# Altium schematic sheet betterfc_v0.2.SchDoc: BetterFC
size A3; DrawnBy: Isaak & Maarten; Revision: V0.1; SheetNumber: 1; SheetTotal: 1
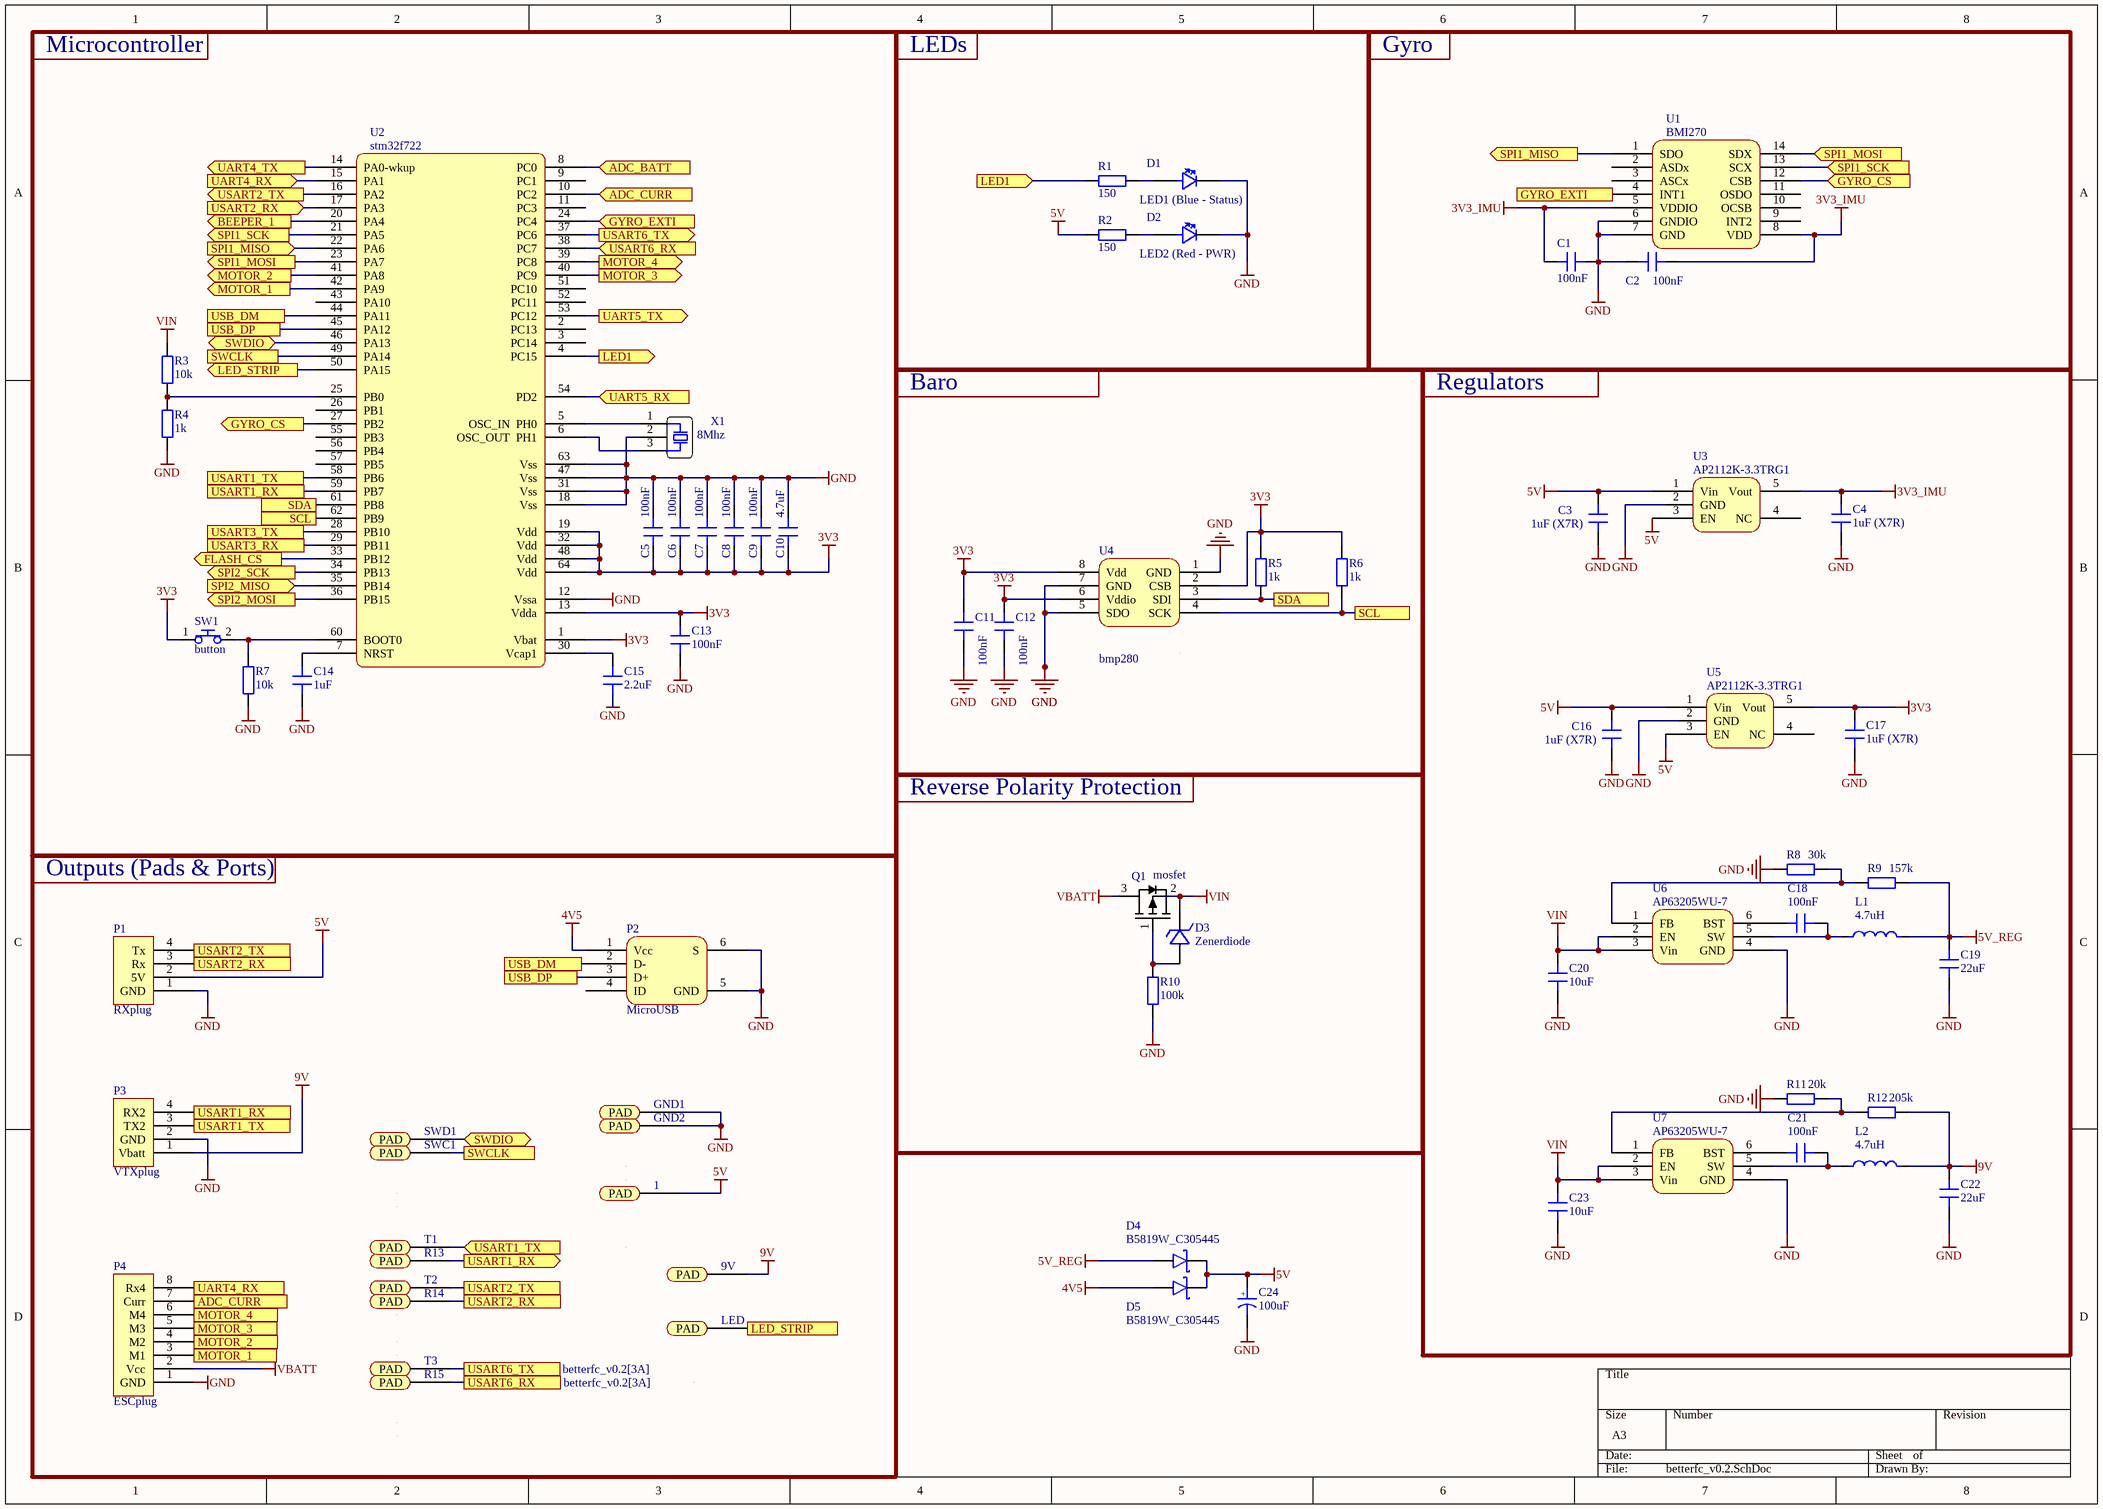
[diagram p0: betterfc_v0.2.SchDoc]

## Parts
1  PAD  [pad]  (value not drawn)
9V  PAD  [pad]  (value not drawn)
C1  100nF  [0603]
C2  100nF  [0603]
C3  1uF (X7R)  [0603]
C4  1uF (X7R)  [0603]
C5  100nF  [0603]
C6  100nF  [0603]
C7  100nF  [0603]
C8  100nF  [0603]
C9  100nF  [0603]
C10  4.7uF  [0603]
C11  100nF  [0603]
C12  100nF  [0603]
C13  100nF  [0603]
C14  1uF  [0603]
C15  2.2uF  [0603]
C16  1uF (X7R)  [0603]
C17  1uF (X7R)  [0603]
C18  100nF  [0603]
C19  22uF  [0603]
C20  10uF  [0603]
C21  100nF  [0603]
C22  22uF  [0603]
C23  10uF  [0603]
C24  100uF  [polorizedC - duplicate]
D1  LED1 (Blue - Status)  [0603]
D2  LED2 (Red - PWR)  [0603]
D3  Zenerdiode  [Zenerdiode]
D4  B5819W_C305445  [scottydiode]
D5  B5819W_C305445  [scottydiode]
GND1  PAD  [pad]  (value not drawn)
GND2  PAD  [pad]  (value not drawn)
L1  4.7uH  [coil]
L2  4.7uH  [coil]
LED  PAD  [pad]  (value not drawn)
P1  RXplug  [RXplug]
P2  MicroUSB  [microUSB]
P3  VTXplug  [VTXplug]
P4  ESCplug  [ESCplug]
Q1  mosfet  [mosfet]
R1  150  [0603]
R2  150  [0603]
R3  10k  [0603]
R4  1k  [0603]
R5  1k  [0603]
R6  1k  [0603]
R7  10k  [0603]
R8  30k  [0603]
R9  157k  [0603]
R10  100k  [0603]
R11  20k  [0603]
R12  205k  [0603]
R13  PAD  [pad]  (value not drawn)
R14  PAD  [pad]  (value not drawn)
R15  PAD  [pad]  (value not drawn)
SW1  button  [button]
SWC1  PAD  [pad]  (value not drawn)
SWD1  PAD  [pad]  (value not drawn)
T1  PAD  [pad]  (value not drawn)
T2  PAD  [pad]  (value not drawn)
T3  PAD  [pad]  (value not drawn)
U1  BMI270  [bmi270]
U2  stm32f722  [STM32F722RET6]
U3  AP2112K-3.3TRG1  [LDO]
U4  bmp280  [bmp280]
U5  AP2112K-3.3TRG1  [LDO]
U6  AP63205WU-7  [AP63205WU-7]
U7  AP63205WU-7  [AP63205WU-7]
X1  8Mhz  [crystal]

## Blocks framed on the sheet
Microcontroller: C5-C10 C13-C15 R3 R4 R7 SW1 U2 X1
LEDs: D1 D2 R1 R2
Gyro: C1 C2 U1
Baro: C11 C12 R5 R6 U4
Regulators: C3 C4 C16-C23 L1 L2 R8 R9 R11 R12 U3 U5-U7
Reverse Polarity Protection: D3 Q1 R10
Outputs (Pads & Ports): 1 9V GND1 GND2 LED P1-P4 R13-R15 SWC1 SWD1 T1-T3

## Ports
ADC_BATT (in), ADC_CURR (in, see betterfc_v0.2[1D]), ADC_CURR (out, see betterfc_v0.2[3A]), BEEPER_1 (out), FLASH_CS (out), GYRO_CS (in, see betterfc_v0.2[1B]), GYRO_CS (out, see betterfc_v0.2[7A]), GYRO_EXTI (in, see betterfc_v0.2[6A]), GYRO_EXTI (out, see betterfc_v0.2[3A]), LED1 (in, see betterfc_v0.2[3A]), LED1 (out, see betterfc_v0.2[4A]), LED_STRIP (out, see betterfc_v0.2[1A]), LED_STRIP (out, see betterfc_v0.2[3D]), MOTOR_1 (out, see betterfc_v0.2[1A]), MOTOR_1 (out, see betterfc_v0.2[1D]), MOTOR_2 (out, see betterfc_v0.2[1A]), MOTOR_2 (out, see betterfc_v0.2[1D]), MOTOR_3 (out, see betterfc_v0.2[1D]), MOTOR_3 (out, see betterfc_v0.2[3A]), MOTOR_4 (out, see betterfc_v0.2[1D]), MOTOR_4 (out, see betterfc_v0.2[3A]), SCL (see betterfc_v0.2[1B]), SCL (see betterfc_v0.2[6B]), SDA (see betterfc_v0.2[1B]), SDA (see betterfc_v0.2[5B]), SPI1_MISO (in, see betterfc_v0.2[6A]), SPI1_MISO (out, see betterfc_v0.2[1A]), SPI1_MOSI (in, see betterfc_v0.2[1A]), SPI1_MOSI (out, see betterfc_v0.2[7A]), SPI1_SCK (in, see betterfc_v0.2[1A]), SPI1_SCK (out, see betterfc_v0.2[7A]), SPI2_MISO (in), SPI2_MOSI (out), SPI2_SCK (out), SWCLK (see betterfc_v0.2[1A]), SWCLK (see betterfc_v0.2[2D]), SWDIO (bidir, see betterfc_v0.2[1A]), SWDIO (bidir, see betterfc_v0.2[2D]), UART4_RX (in, see betterfc_v0.2[1D]), UART4_RX (out, see betterfc_v0.2[1A]), UART4_TX (out), UART5_RX (in), UART5_TX (out), USART1_RX (out, see betterfc_v0.2[1B], betterfc_v0.2[1C]), USART1_RX (see betterfc_v0.2[1B], betterfc_v0.2[2D]), USART1_RX (see betterfc_v0.2[1C], betterfc_v0.2[2D]), USART1_TX (in, see betterfc_v0.2[1B], betterfc_v0.2[1C]), USART1_TX (see betterfc_v0.2[1B], betterfc_v0.2[2D]), USART1_TX (see betterfc_v0.2[1C], betterfc_v0.2[2D]), USART2_RX (in, see betterfc_v0.2[1C], betterfc_v0.2[2D]), USART2_RX (see betterfc_v0.2[1A], betterfc_v0.2[1C]), USART2_RX (see betterfc_v0.2[1A], betterfc_v0.2[2D]), USART2_TX (out, see betterfc_v0.2[1C], betterfc_v0.2[2D]), USART2_TX (see betterfc_v0.2[1A], betterfc_v0.2[1C]), USART2_TX (see betterfc_v0.2[1A], betterfc_v0.2[2D]), USART3_RX, USART3_TX, USART6_RX (in, see betterfc_v0.2[2D]), USART6_RX (see betterfc_v0.2[3A]), USART6_TX (out, see betterfc_v0.2[2D]), USART6_TX (see betterfc_v0.2[3A]), USB_DM (see betterfc_v0.2[1A]), USB_DM (see betterfc_v0.2[2C]), USB_DP (see betterfc_v0.2[1A]), USB_DP (see betterfc_v0.2[2C])

## Nets
3V3: C5.1 C6.1 C7.1 C8.1 C9.1 C10.1 C11.2 C12.1 C13.2 C17.2 R5.2 R6.2 SW1.1 U2.1(Vbat) U2.13(Vdda) U2.19(Vdd) U2.32(Vdd) U2.48(Vdd) U2.64(Vdd) U4.2(CSB) U4.6(Vddio) U4.8(Vdd) U5.5(Vout)
3V3_IMU: C1.1 C2.2 C4.2 U1.5(VDDIO) U1.8(VDD) U3.5(Vout)
4V5: D5.1 P2.1(Vcc)
5V: 1.1(PAD) C3.2 C16.2 C24.2 D4.2 D5.2 P1.2(5V) R2.1 U3.1(Vin) U3.3(EN) U5.1(Vin) U5.3(EN)
5V_REG: C19.2 D4.1 L1.2 R9.2
9V: 9V.1(PAD) C22.2 L2.2 P3.1(Vbatt) R12.2
GND: C1.2 C2.1 C3.1 C4.1 C5.2 C6.2 C7.2 C8.2 C9.2 C10.2 C11.1 C12.2 C13.1 C14.1 C15.1 C16.1 C17.1 C19.1 C20.1 C22.1 C23.1 C24.1 D1.2(+) D2.2(+) GND1.1(PAD) GND2.1(PAD) P1.1(GND) P2.5(GND) P2.6(S) P3.2(GND) P4.1(GND) R4.1 R7.1 R8.2 R10.1 R11.2 U1.6(GNDIO) U1.7(GND) U2.12(Vssa) U2.18(Vss) U2.31(Vss) U2.47(Vss) U2.63(Vss) U3.2(GND) U4.1(GND) U4.5(SDO) U4.7(GND) U5.2(GND) U6.4(GND) U7.4(GND) X1.2
VBATT: P4.2(Vcc) Q1.3
VIN: C20.2 C23.2 D3.2 Q1.2 R3.2 U6.2(EN) U6.3(Vin) U7.2(EN) U7.3(Vin)
ADC_BATT: U2.8(PC0) ; port ADC_BATT
ADC_CURR: P4.7(Curr) U2.10(PC2) ; port ADC_CURR
BEEPER_1: U2.20(PA4) ; port BEEPER_1
FLASH_CS: U2.33(PB12) ; port FLASH_CS
GYRO_CS: U1.12(CSB) U2.27(PB2) ; port GYRO_CS
GYRO_EXTI: U2.24(PC4) ; port GYRO_EXTI
LED1: R1.1 U2.4(PC15) ; port LED1
LED_STRIP: LED.1(PAD) U2.50(PA15) ; port LED_STRIP
MOTOR_1: P4.3(M1) U2.42(PA9) ; port MOTOR_1
MOTOR_2: P4.4(M2) U2.41(PA8) ; port MOTOR_2
MOTOR_3: P4.5(M3) U2.40(PC9) ; port MOTOR_3
MOTOR_4: P4.6(M4) U2.39(PC8) ; port MOTOR_4
SCL: R6.1 U2.62(PB9) U4.4(SCK) ; port SCL
SDA: R5.1 U2.61(PB8) U4.3(SDI) ; port SDA
SPI1_MISO: U1.1(SDO) U2.22(PA6) ; port SPI1_MISO
SPI1_MOSI: U1.14(SDX) U2.23(PA7) ; port SPI1_MOSI
SPI1_SCK: U1.13(SCX) U2.21(PA5) ; port SPI1_SCK
SPI2_MISO: U2.35(PB14) ; port SPI2_MISO
SPI2_MOSI: U2.36(PB15) ; port SPI2_MOSI
SPI2_SCK: U2.34(PB13) ; port SPI2_SCK
SWCLK: SWC1.1(PAD) U2.49(PA14) ; port SWCLK
SWDIO: SWD1.1(PAD) U2.46(PA13) ; port SWDIO
UART4_RX: P4.8(Rx4) U2.15(PA1) ; port UART4_RX
UART4_TX: U2.14(PA0-wkup) ; port UART4_TX
UART5_RX: U2.54(PD2) ; port UART5_RX
UART5_TX: U2.53(PC12) ; port UART5_TX
USART1_RX: P3.4(RX2) R13.1(PAD) U2.59(PB7) ; port USART1_RX
USART1_TX: P3.3(TX2) T1.1(PAD) U2.58(PB6) ; port USART1_TX
USART2_RX: P1.3(Rx) R14.1(PAD) U2.17(PA3) ; port USART2_RX
USART2_TX: P1.4(Tx) T2.1(PAD) U2.16(PA2) ; port USART2_TX
USART3_RX: U2.29(PB11) ; port USART3_RX
USART3_TX: U2.28(PB10) ; port USART3_TX
USART6_RX: R15.1(PAD) U2.38(PC7) ; port USART6_RX
USART6_TX: T3.1(PAD) U2.37(PC6) ; port USART6_TX
USB_DM: P2.2(D-) U2.44(PA11) ; port USB_DM
USB_DP: P2.3(D+) U2.45(PA12) ; port USB_DP
NetC14_2: C14.2 U2.7(NRST)
NetC15_2: C15.2 U2.30(Vcap1)
NetC18_1: C18.1 L1.1 U6.5(SW)
NetC18_2: C18.2 U6.6(BST)
NetC21_1: C21.1 L2.1 U7.5(SW)
NetC21_2: C21.2 U7.6(BST)
NetD1_1: D1.1 R1.2
NetD2_1: D2.1 R2.2
NetD3_1: D3.1 Q1.1 R10.2
NetR3_1: R3.1 R4.2 U2.25(PB0)
NetR7_2: R7.2 SW1.2 U2.60(BOOT0)
NetR8_1: R8.1 R9.1 U6.1(FB)
NetR11_1: R11.1 R12.1 U7.1(FB)
NetU2_5: U2.5(OSC_IN__PH0) X1.1
NetU2_6: U2.6(OSC_OUT__PH1) X1.3

Not connected (* = marked no-connect by the designer): P2 4(ID); U1 2(ASDx) 3(ASCx) 4(INT1) 9(INT2) 10(OCSB) 11(OSDO); U2 2(PC13) 3(PC14) 9(PC1) 11(PC3) 26(PB1) 43(PA10) 51(PC10) 52(PC11) 55(PB3) 56(PB4) 57(PB5); U3 4(NC); U5 4(NC)

## Notes on the sheet
- (in symbol polorized C) +

## Library data of the parts
C1-C23 = C
C24 = polorized C
D1 D2 = LED
D4 D5 = ScottyDiode
L1 L2 = coil
R1-R12 = R
U3 U5 = LDO
X1 = Crystal